# Altium schematic sheet modem.SchDoc
size A4; SheetNumber: 1; SheetTotal: 1
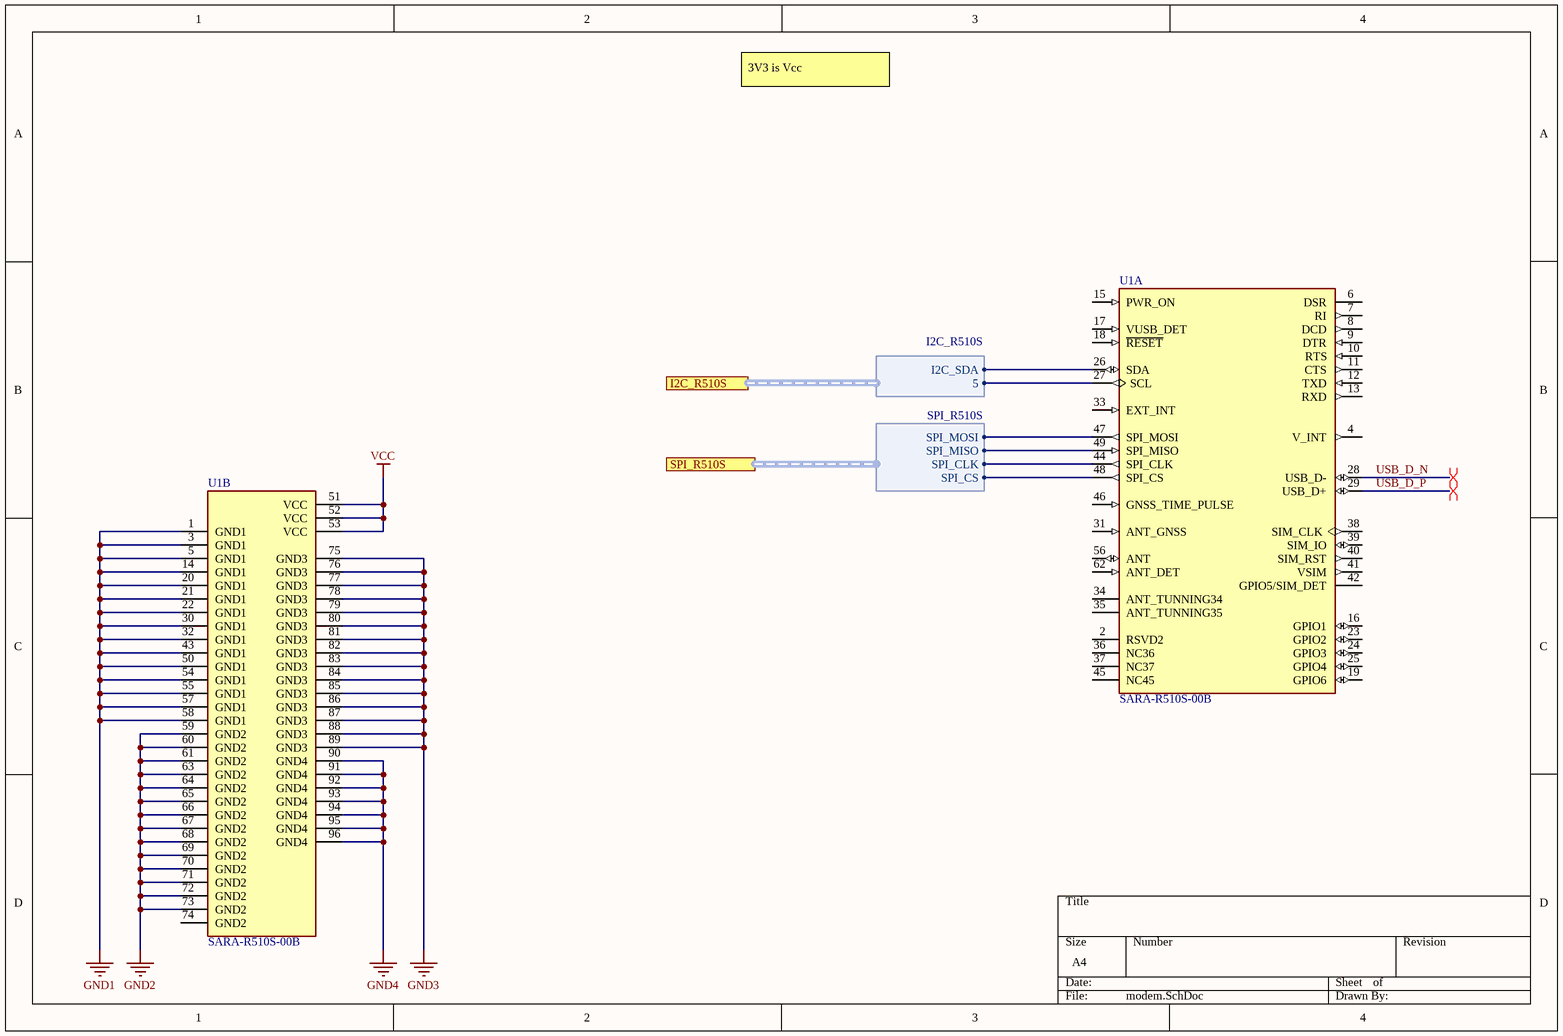
[diagram p0: modem.SchDoc]

## Parts
U1  SARA-R510S-00B  [MODULE_SARA-R510S-00B - CORRECTED]  (parts A,B of 2)

## Ports
I2C_R510S (harness I2C_R510S), SPI_R510S (harness SPI_R510S)

## Harnesses
SPI_R510S: SPI_MOSI, SPI_MISO, SPI_CLK, SPI_CS
I2C_R510S: I2C_SDA, 5

## Nets
GND1: U1.1(GND1) U1.3(GND1) U1.5(GND1) U1.14(GND1) U1.20(GND1) U1.21(GND1) U1.22(GND1) U1.30(GND1) U1.32(GND1) U1.43(GND1) U1.50(GND1) U1.54(GND1) U1.55(GND1) U1.57(GND1) U1.58(GND1)
GND2: U1.59(GND2) U1.60(GND2) U1.61(GND2) U1.63(GND2) U1.64(GND2) U1.65(GND2) U1.66(GND2) U1.67(GND2) U1.68(GND2) U1.69(GND2) U1.70(GND2) U1.71(GND2) U1.72(GND2) U1.73(GND2)
GND3: U1.75(GND3) U1.76(GND3) U1.77(GND3) U1.78(GND3) U1.79(GND3) U1.80(GND3) U1.81(GND3) U1.82(GND3) U1.83(GND3) U1.84(GND3) U1.85(GND3) U1.86(GND3) U1.87(GND3) U1.88(GND3) U1.89(GND3)
GND4: U1.90(GND4) U1.91(GND4) U1.92(GND4) U1.93(GND4) U1.94(GND4) U1.95(GND4) U1.96(GND4)
VCC: U1.51(VCC) U1.52(VCC) U1.53(VCC)
USB_D_N: U1.28(USB_D-)
USB_D_P: U1.29(USB_D+)
NetU1_26: U1.26(SDA) ; port I2C_R510S.I2C_SDA
NetU1_27: U1.27(SCL) ; port I2C_R510S.5
NetU1_44: U1.44(SPI_CLK) ; port SPI_R510S.SPI_CLK
NetU1_47: U1.47(SPI_MOSI) ; port SPI_R510S.SPI_MOSI
NetU1_48: U1.48(SPI_CS) ; port SPI_R510S.SPI_CS
NetU1_49: U1.49(SPI_MISO) ; port SPI_R510S.SPI_MISO

Not connected (* = marked no-connect by the designer): U1 2(RSVD2) 4(V_INT) 6(DSR) 7(RI) 8(DCD) 9(DTR) 10(RTS) 11(CTS) 12(TXD) 13(RXD) 15(PWR_ON) 16(GPIO1) 17(VUSB_DET) 18(~{RESET}) 19(GPIO6) 23(GPIO2) 24(GPIO3) 25(GPIO4) 31(ANT_GNSS) 33(EXT_INT) 34(ANT_TUNNING34) 35(ANT_TUNNING35) 36(NC36) 37(NC37) 38(SIM_CLK) 39(SIM_IO) 40(SIM_RST) 41(VSIM) 42(GPIO5/SIM_DET) 45(NC45) 46(GNSS_TIME_PULSE) 56(ANT) 62(ANT_DET) 74(GND2)

## Layout directives
differential pair: USB_D_N, USB_D_P

## Notes on the sheet
- 3V3 is Vcc

## Library data of the parts
U1 = SARA-R510S-00B: Cellular LTE Cat M1, LTE Cat NB2 Transceiver Module 600MHz, 700MHz, 750MHz, 800MHz, 850MHz, 900MHz, 1.7GHz, 1.8GHz, 1.9GHz, 2.1GHz Antenna Not Included Surface Mount; MF: U-Blox; Package: SMD-96 u-blox; Availability: In Stock; Value: *; MP: SARA-R510S-00B; Purchase-URL: https://pricing.snapeda.com/search/part/SARA-R510S-00B/?ref=eda; Check_prices: https://www.snapeda.com/parts/SARA-R510S-00B/u-blox/view-part/?ref=eda; SnapEDA_Link: https://www.snapeda.com/parts/SARA-R510S-00B/u-blox/view-part/?ref=snap; Price: None